# Altium schematic sheet CAN.SchDoc
size A3
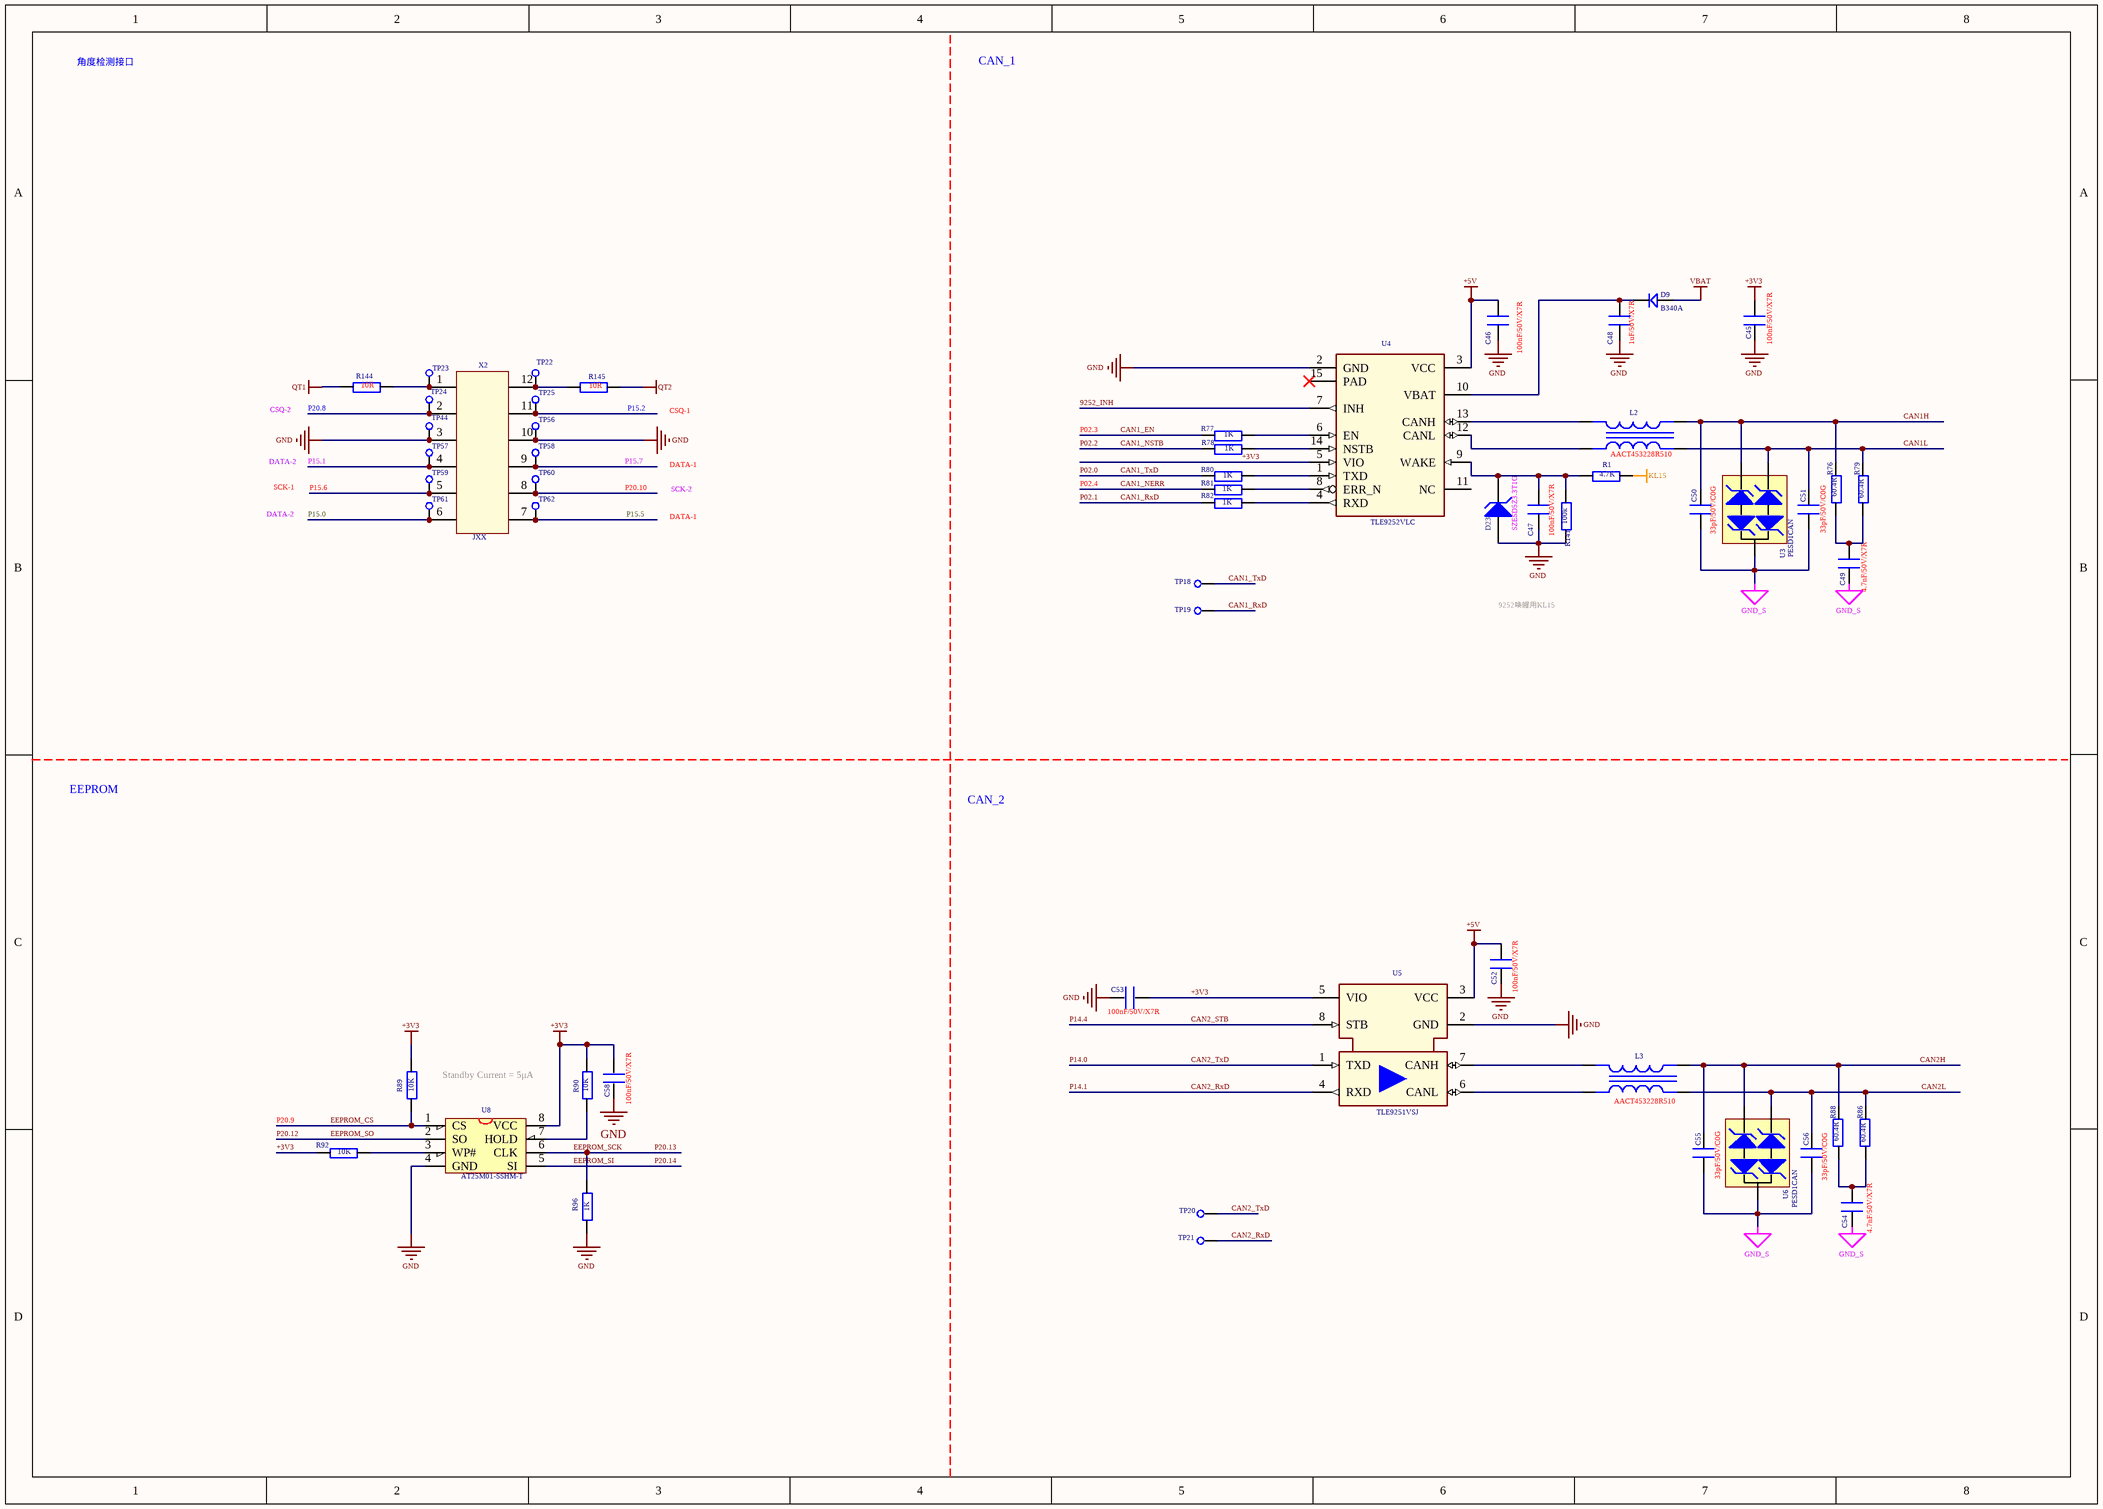
[diagram p0: CAN.SchDoc]

## Parts
C45  100nF/50V/X7R  [C0603P]
C46  100nF/50V/X7R  [C0603P]
C47  100nF/50V/X7R  [C0603P]
C48  1uF/50V/X7R  [C0805]
C49  4.7nF/50V/X7R  [C0603P]
C50  33pF/50V/C0G  [C0603P]
C51  33pF/50V/C0G  [C0603P]
C52  100nF/50V/X7R  [C0603P]
C53  100nF/50V/X7R  [C0603P]
C54  4.7nF/50V/X7R  [C0603P]
C55  33pF/50V/C0G  [C0603P]
C56  33pF/50V/C0G  [C0603P]
C58  100nF/50V/X7R  [C0603P]
D9  B340A  [DO-214AC]
D23  SZESD5Z3.3T1G  [SOD-523F]
L2  AACT453228R510  [ACT45B]
L3  AACT453228R510  [ACT45B]
R1  4.7K  [0603P]
R76  60.4R  [0603P]
R77  1K  [0603P]
R78  1K  [0603P]
R79  60.4R  [0603P]
R80  1K  [0603P]
R81  1K  [0603P]
R82  1K  [0603P]
R86  60.4R  [0603P]
R88  60.4R  [0603P]
R89  10K  [0603P]
R90  10K  [0603P]
R92  10K  [0603P]
R96  1K  [0603P]
R141  100k  [0603P]
R144  10R  [0603P]
R145  10R  [0603P]
TP18  测试点  [测试点]  (value not drawn)
TP19  测试点  [测试点]  (value not drawn)
TP20  测试点  [测试点]  (value not drawn)
TP21  测试点  [测试点]  (value not drawn)
TP22  测试点  [测试点]  (value not drawn)
TP23  测试点  [测试点]  (value not drawn)
TP24  测试点  [测试点]  (value not drawn)
TP25  测试点  [测试点]  (value not drawn)
TP44  测试点  [测试点]  (value not drawn)
TP56  测试点  [测试点]  (value not drawn)
TP57  测试点  [测试点]  (value not drawn)
TP58  测试点  [测试点]  (value not drawn)
TP59  测试点  [测试点]  (value not drawn)
TP60  测试点  [测试点]  (value not drawn)
TP61  测试点  [测试点]  (value not drawn)
TP62  测试点  [测试点]  (value not drawn)
U3  PESD1CAN  [SOT-23R]
U4  TLE9252VLC  [SOP14]
U5  TLE9251VSJ  [SOIC127P600X175-8N-3]
U6  PESD1CAN  [SOT-23R]
U8  AT25M01-SSHM-T  [SOIC-8]
X2  JXX  [HDR2X6]

## Nets
+3V3: C45.1 C53.1 C58.1 R89.2 R90.2 R92.1 U4.5(VIO) U5.5(VIO) U8.8(VCC)
+5V: C46.1 C52.2 U4.3(VCC) U5.3(VCC)
GND: C45.2 C46.2 C47.2 C48.2 C52.1 C53.2 C58.2 D23.2(A) R96.1 R141.1 TP44.1 TP56.1 U4.2(GND) U5.2(GND) U8.4(GND) X2.3 X2.10
GND_S: C49.1 C50.1 C51.1 C54.1 C55.1 C56.1 U3.3 U6.3
KL15: R1.2
QT1: R144.1
QT2: R145.2
VBAT: D9.1
9252_INH: U4.7(INH)
CAN1_EN: R77.1  [also labelled P02.3]
CAN1_NERR: R81.1  [also labelled P02.4]
CAN1_NSTB: R78.1  [also labelled P02.2]
CAN1_RxD: R82.1 TP19.1  [also labelled P02.1]
CAN1_TxD: R80.1 TP18.1  [also labelled P02.0]
CAN1H: C50.2 L2.3(Sec-) R76.2 U3.2
CAN1L: C51.2 L2.4(Pri-) R79.2 U3.1
CAN2_RxD: TP21.1 U5.4(RXD)  [also labelled P14.1]
CAN2_STB: U5.8(STB)  [also labelled P14.4]
CAN2_TxD: TP20.1 U5.1(TXD)  [also labelled P14.0]
CAN2H: C55.2 L3.3(Sec-) R88.1 U6.2
CAN2L: C56.2 L3.4(Pri-) R86.1 U6.1
EEPROM_CS: R89.1 U8.1(CS)  [also labelled P20.9]
EEPROM_SCK: R96.2 U8.6(CLK)  [also labelled P20.13]
EEPROM_SI: U8.5(SI)  [also labelled P20.14]
EEPROM_SO: U8.2(SO)  [also labelled P20.12]
P15.0: TP61.1 X2.6
P15.1: TP57.1 X2.4
P15.2: TP25.1 X2.11
P15.5: TP62.1 X2.7
P15.6: TP59.1 X2.5
P15.7: TP58.1 X2.9
P20.8: TP24.1 X2.2
P20.10: TP60.1 X2.8
NetC47_1: C47.1 D23.1(K) R1.1 R141.2 U4.9(WAKE)
NetC48_1: C48.1 D9.2 U4.10(VBAT)
NetC49_2: C49.2 R76.1 R79.1
NetC54_2: C54.2 R86.2 R88.2
NetL2_1: L2.1(Pri+) U4.12(CANL)
NetL2_2: L2.2(Sec+) U4.13(CANH)
NetL3_1: L3.1(Pri+) U5.6(CANL)
NetL3_2: L3.2(Sec+) U5.7(CANH)
NetR77_2: R77.2 U4.6(EN)
NetR78_2: R78.2 U4.14(NSTB)
NetR80_2: R80.2 U4.1(TXD)
NetR81_2: R81.2 U4.8(ERR_N)
NetR82_2: R82.2 U4.4(RXD)
NetR90_1: R90.1 U8.7(HOLD)
NetR92_2: R92.2 U8.3(WP#)
NetR144_2: R144.2 TP23.1 X2.1
NetR145_1: R145.1 TP22.1 X2.12

Not connected (* = marked no-connect by the designer): U4 11(NC) 15(PAD)*

## Notes on the sheet
- 角度检测接口
- CAN_1
- 9252唤睲用KL15
- EEPROM
- CAN_2
- Standby Current = 5μA
- Labels drawn without touching a wire or pin: CSQ-1, CSQ-2, DATA-1, DATA-2, SCK-1, SCK-2

## Library data of the parts
C45-C56 C58 = C
D9 = D
D23 = D Zener: Zener Diode; Published: 8-Jun-2000; LatestRevisionDate: 17-Jul-2002; LatestRevisionNote: Re-released for DXP Platform.; PackageReference: DIODE-0.7; Publisher: Altium Limited; PackageDescription: Diode, Thru-Hole; 2 Leads; 0.7 in Pin Spacing
L2 L3 = ACT45B-510-2P
R1 R76-R82 R86 R88-R90 R92 R96 R141 R144 R145 = R
U4 = TLE9252VLC: High Speed CAN FD Transceiver; Manufacturer: Infineon Technologies; ManufacturerPartNumber: TLE9252VLC; PackageReference: PG-TSON-14
U5 = TLE9251VSJ: High Speed CAN Transceiver; Manufacturer: Infineon Technologies; ManufacturerPartNumber: TLE9251VSJ; PackageReference: PG-DSO-8-44
U8 = W25X16: W25X16;SST25VF016;MX25L1605